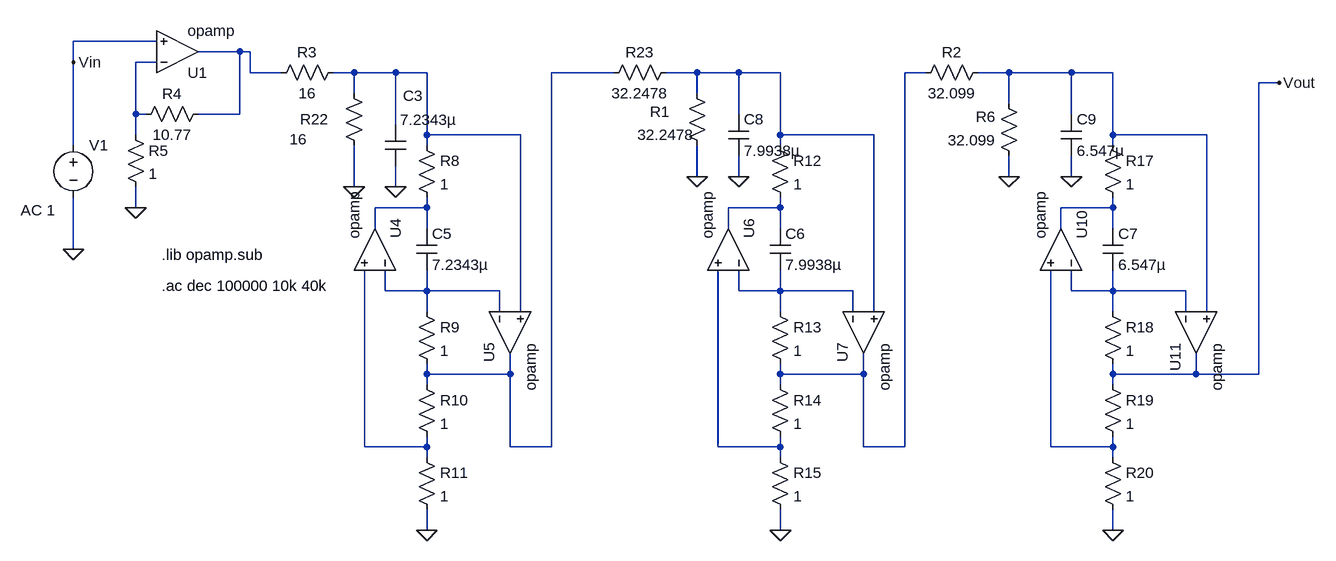
[diagram p0: schematic circuitoAcopladoActivado.asc]
circuitoAcopladoActivado.asc, the LTspice schematic file:
Version 4
SHEET 1 1864 680
WIRE -576 -96 -704 -96
WIRE -448 -80 -512 -80
WIRE -432 -80 -448 -80
WIRE -704 -64 -704 -96
WIRE -576 -64 -608 -64
WIRE -432 -48 -432 -80
WIRE -384 -48 -432 -48
WIRE -272 -48 -304 -48
WIRE -208 -48 -272 -48
WIRE -160 -48 -208 -48
WIRE 128 -48 32 -48
WIRE 256 -48 208 -48
WIRE 320 -48 256 -48
WIRE 384 -48 320 -48
WIRE 608 -48 576 -48
WIRE 736 -48 688 -48
WIRE 832 -48 736 -48
WIRE 896 -48 832 -48
WIRE 1152 -32 1120 -32
WIRE -272 -16 -272 -48
WIRE 256 -16 256 -48
WIRE 736 0 736 -48
WIRE -608 16 -608 -64
WIRE -592 16 -608 16
WIRE -448 16 -448 -80
WIRE -448 16 -512 16
WIRE 320 16 320 -48
WIRE 832 16 832 -48
WIRE -208 32 -208 -48
WIRE -608 48 -608 16
WIRE -160 48 -160 -48
WIRE -16 48 -160 48
WIRE 384 48 384 -48
WIRE 528 48 384 48
WIRE 896 48 896 -48
WIRE 1040 48 896 48
WIRE -704 64 -704 -64
WIRE -160 64 -160 48
WIRE 384 64 384 48
WIRE 896 64 896 48
WIRE 256 112 256 64
WIRE 320 112 320 80
WIRE 736 112 736 80
WIRE 832 112 832 80
WIRE -272 128 -272 64
WIRE -208 128 -208 96
WIRE -608 160 -608 128
WIRE -160 160 -160 144
WIRE -160 160 -240 160
WIRE 384 160 384 144
WIRE 384 160 304 160
WIRE 896 160 896 144
WIRE 896 160 816 160
WIRE -240 192 -240 160
WIRE -160 192 -160 160
WIRE 304 192 304 160
WIRE 384 192 384 160
WIRE 816 192 816 160
WIRE 896 192 896 160
WIRE -704 224 -704 144
WIRE -224 288 -224 256
WIRE -160 288 -160 256
WIRE -160 288 -224 288
WIRE -48 288 -160 288
WIRE 320 288 320 256
WIRE 384 288 384 256
WIRE 384 288 320 288
WIRE 496 288 384 288
WIRE 832 288 832 256
WIRE 896 288 896 256
WIRE 896 288 832 288
WIRE 1008 288 896 288
WIRE -160 320 -160 288
WIRE -48 320 -48 288
WIRE -16 320 -16 48
WIRE 384 320 384 288
WIRE 496 320 496 288
WIRE 528 320 528 48
WIRE 896 320 896 288
WIRE 1008 320 1008 288
WIRE 1040 320 1040 48
WIRE -160 416 -160 400
WIRE -32 416 -32 384
WIRE -32 416 -160 416
WIRE 384 416 384 400
WIRE 512 416 512 384
WIRE 512 416 384 416
WIRE 896 416 896 400
WIRE 1024 416 1024 384
WIRE 1024 416 896 416
WIRE 1120 416 1120 -32
WIRE 1120 416 1024 416
WIRE -160 432 -160 416
WIRE 384 432 384 416
WIRE 896 432 896 416
WIRE -256 528 -256 256
WIRE -160 528 -160 512
WIRE -160 528 -256 528
WIRE -32 528 -32 416
WIRE 32 528 32 -48
WIRE 32 528 -32 528
WIRE 288 528 288 256
WIRE 384 528 384 512
WIRE 384 528 288 528
WIRE 512 528 512 416
WIRE 576 528 576 -48
WIRE 576 528 512 528
WIRE 800 528 800 256
WIRE 896 528 896 512
WIRE 896 528 800 528
WIRE -160 544 -160 528
WIRE 384 544 384 528
WIRE 896 544 896 528
WIRE -160 656 -160 624
WIRE 384 656 384 624
WIRE 896 656 896 624
FLAG -704 224 0
FLAG -704 -64 Vin
FLAG -160 656 0
FLAG -272 128 0
FLAG 384 656 0
FLAG 256 112 0
FLAG 896 656 0
FLAG 1152 -32 Vout
FLAG -208 128 0
FLAG 320 112 0
FLAG 832 112 0
FLAG 736 112 0
FLAG -608 160 0
SYMBOL voltage -704 48 R0
WINDOW 123 -81 116 Left 2
WINDOW 39 0 0 Left 0
SYMATTR Value2 AC 1
SYMATTR InstName V1
SYMATTR Value ""
SYMBOL res -176 48 R0
SYMATTR InstName R8
SYMATTR Value 1
SYMBOL cap -176 192 R0
SYMATTR InstName C5
SYMATTR Value 7.2343µ
SYMBOL res -176 304 R0
SYMATTR InstName R9
SYMATTR Value 1
SYMBOL res -176 416 R0
SYMATTR InstName R10
SYMATTR Value 1
SYMBOL res -176 528 R0
SYMATTR InstName R11
SYMATTR Value 1
SYMBOL OpAmps\\opamp -176 224 M270
SYMATTR InstName U4
SYMBOL OpAmps\\opamp -96 352 M90
SYMATTR InstName U5
SYMBOL res 240 -32 R0
WINDOW 0 -57 44 Left 2
WINDOW 3 -76 80 Left 2
SYMATTR InstName R1
SYMATTR Value 32.2478
SYMBOL res 368 48 R0
SYMATTR InstName R12
SYMATTR Value 1
SYMBOL cap 368 192 R0
SYMATTR InstName C6
SYMATTR Value 7.9938µ
SYMBOL res 368 304 R0
SYMATTR InstName R13
SYMATTR Value 1
SYMBOL res 368 416 R0
SYMATTR InstName R14
SYMATTR Value 1
SYMBOL res 368 528 R0
SYMATTR InstName R15
SYMATTR Value 1
SYMBOL OpAmps\\opamp 368 224 M270
SYMATTR InstName U6
SYMBOL OpAmps\\opamp 448 352 M90
SYMATTR InstName U7
SYMBOL res 880 48 R0
SYMATTR InstName R17
SYMATTR Value 1
SYMBOL cap 880 192 R0
SYMATTR InstName C7
SYMATTR Value 6.547µ
SYMBOL res 880 304 R0
SYMATTR InstName R18
SYMATTR Value 1
SYMBOL res 880 416 R0
SYMATTR InstName R19
SYMATTR Value 1
SYMBOL res 880 528 R0
SYMATTR InstName R20
SYMATTR Value 1
SYMBOL OpAmps\\opamp 880 224 M270
SYMATTR InstName U10
SYMBOL OpAmps\\opamp 960 352 M90
SYMATTR InstName U11
SYMBOL res -288 -64 R90
WINDOW 0 0 56 VBottom 2
WINDOW 3 32 56 VTop 2
SYMATTR InstName R3
SYMATTR Value 16
SYMBOL res -288 -32 R0
WINDOW 0 -67 56 Left 2
WINDOW 3 -83 87 Left 2
SYMATTR InstName R22
SYMATTR Value 16
SYMBOL res 224 -64 R90
WINDOW 0 0 56 VBottom 2
WINDOW 3 32 56 VTop 2
SYMATTR InstName R23
SYMATTR Value 32.2478
SYMBOL res 704 -64 R90
WINDOW 0 0 56 VBottom 2
WINDOW 3 32 56 VTop 2
SYMATTR InstName R2
SYMATTR Value 32.099
SYMBOL res 752 96 R180
WINDOW 0 36 76 Left 2
WINDOW 3 36 40 Left 2
SYMATTR InstName R6
SYMATTR Value 32.099
SYMBOL cap -224 32 R0
WINDOW 0 27 -44 Left 2
WINDOW 3 23 -7 Left 2
SYMATTR InstName C3
SYMATTR Value 7.2343µ
SYMBOL cap 304 16 R0
SYMATTR InstName C8
SYMATTR Value 7.9938µ
SYMBOL cap 816 16 R0
SYMATTR InstName C9
SYMATTR Value 6.547µ
SYMBOL OpAmps\\opamp -544 -16 M180
SYMATTR InstName U1
SYMBOL res -496 0 R90
WINDOW 0 0 56 VBottom 2
WINDOW 3 32 56 VTop 2
SYMATTR InstName R4
SYMATTR Value 10.77
SYMBOL res -624 32 R0
SYMATTR InstName R5
SYMATTR Value 1
TEXT -568 280 Left 2 !.ac dec 100000 10k 40k
TEXT -568 232 Left 2 !.lib opamp.sub

The netlist it stands for:
* circuitoAcopladoActivado.asc
V1 Vin 0 AC 1
R8 N003 N008 1
C5 N008 N011 7.2343µ
R9 N011 N004 1
R10 N004 N014 1
R11 N014 0 1
XU4 N011 N014 N008 opamp Aol=100K GBW=10Meg  ; pins invin noninvin out
XU5 N011 N003 N004 opamp Aol=100K GBW=10Meg  ; pins invin noninvin out
R1 N005 0 32.2478
R12 N005 N009 1
C6 N009 N012 7.9938µ
R13 N012 N006 1
R14 N006 N015 1
R15 N015 0 1
XU6 N012 N015 N009 opamp Aol=100K GBW=10Meg  ; pins invin noninvin out
XU7 N012 N005 N006 opamp Aol=100K GBW=10Meg  ; pins invin noninvin out
R17 N007 N010 1
C7 N010 N013 6.547µ
R18 N013 Vout 1
R19 Vout N016 1
R20 N016 0 1
XU10 N013 N016 N010 opamp Aol=100K GBW=10Meg  ; pins invin noninvin out
XU11 N013 N007 Vout opamp Aol=100K GBW=10Meg  ; pins invin noninvin out
R3 N003 N001 16
R22 N003 0 16
R23 N005 N004 32.2478
R2 N007 N006 32.099
R6 0 N007 32.099
C3 N003 0 7.2343µ
C8 N005 0 7.9938µ
C9 N007 0 6.547µ
XU1 N002 Vin N001 opamp Aol=100K GBW=10Meg  ; pins invin noninvin out
R4 N001 N002 10.77
R5 N002 0 1
.ac dec 100000 10k 40k
.lib opamp.sub
.backanno
.end